# EAGLE design WD1M_BTLE_JDY-08 (EAGLE 7.5.0)
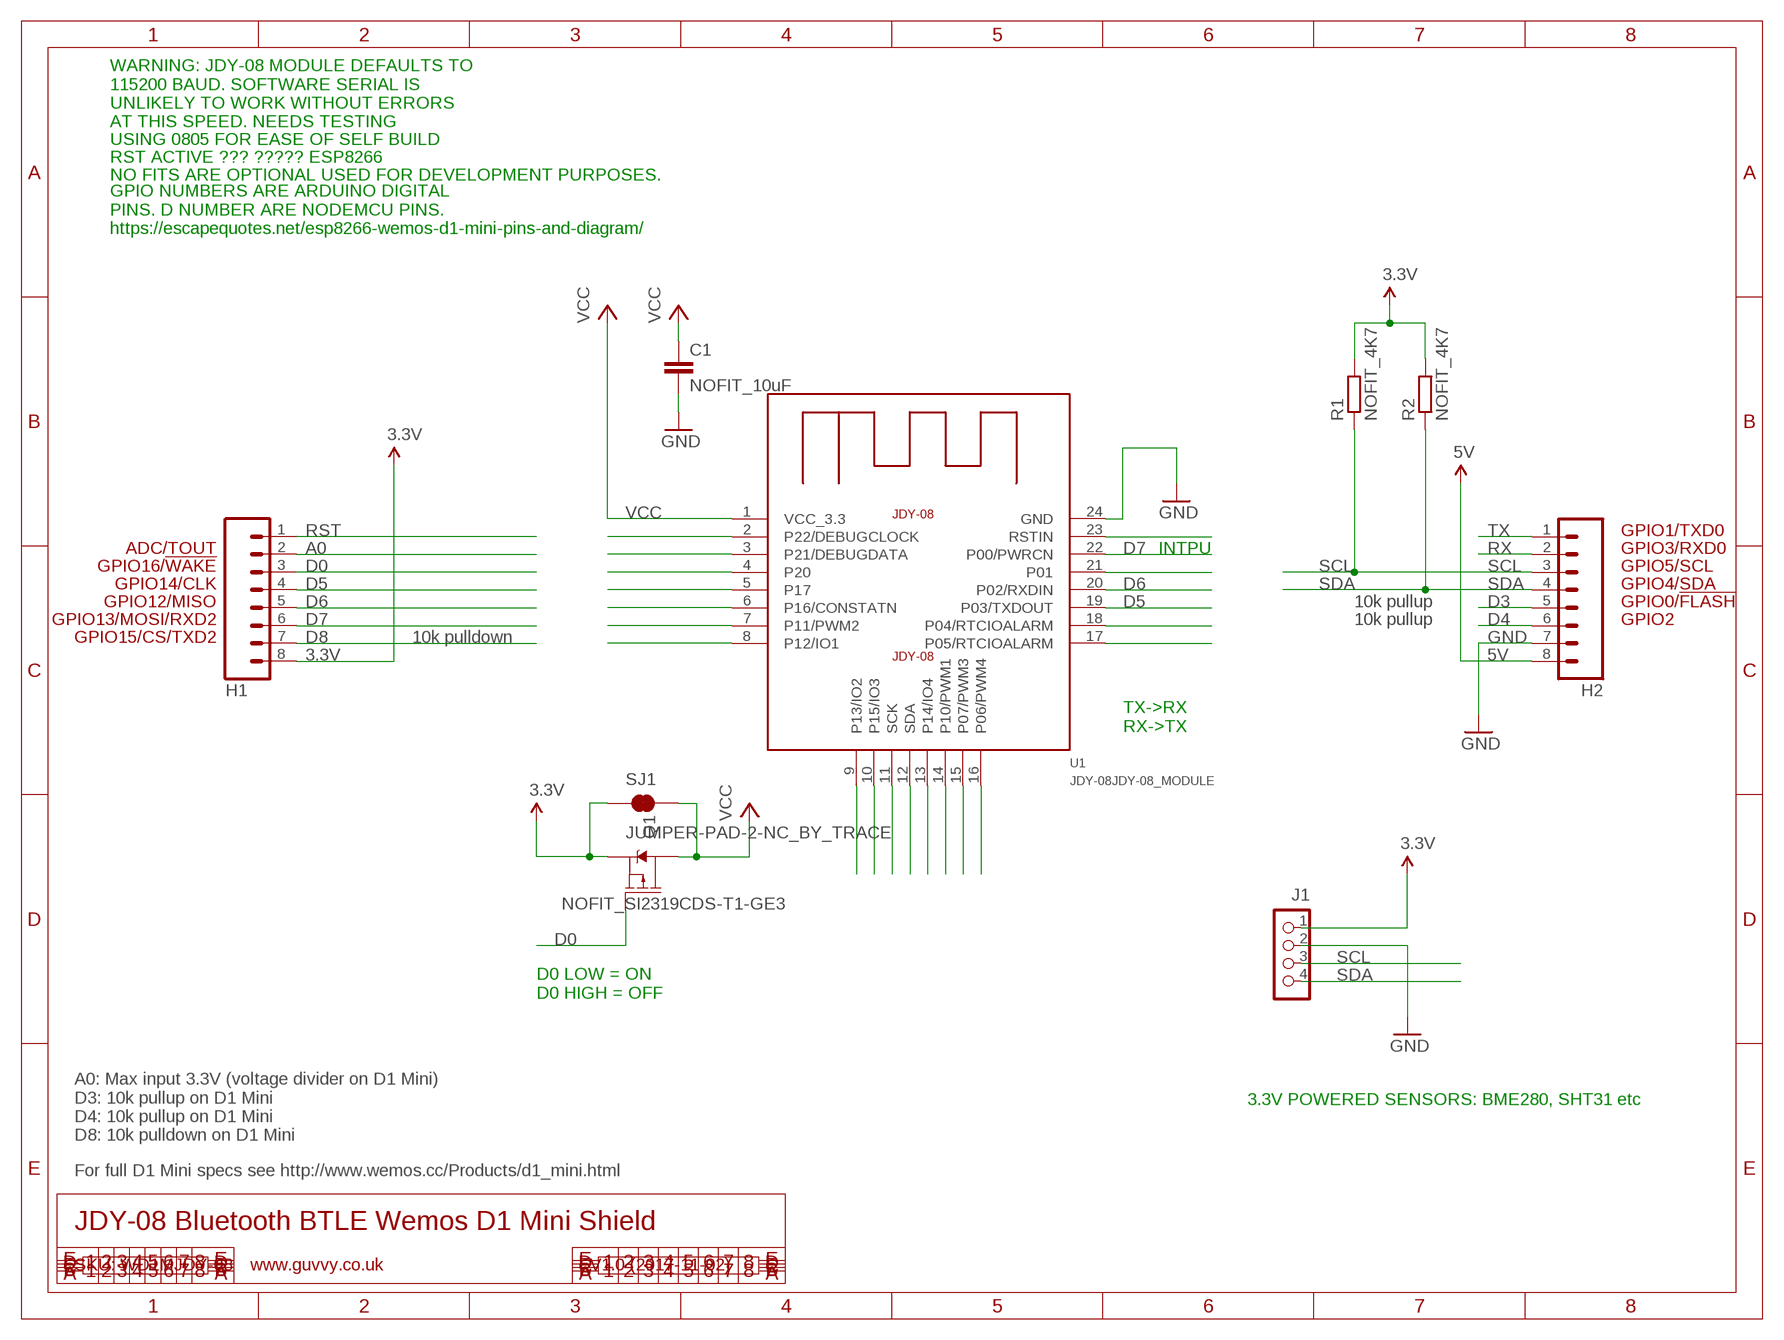
[diagram p0: schematic, sheet 1]

## Parts
C1  NOFIT_10uF  C-EUC0805K  [C0805K]
H1  M08  [1X08]
H2  M08  [1X08]
J1  CON_HEADER_1X04  [M1X4]
Q1  NOFIT_SI2319CDS-T1-GE3  MOSFET_PCH-IRLML2244  [SOT23-3]
R1  NOFIT_4K7  R-EU_R0805  [R0805]
R2  NOFIT_4K7  R-EU_R0805  [R0805]
SJ1  JUMPER-PAD-2-NC_BY_TRACE  [PAD-JUMPER-2-NC_BY_TRACE_YES_SILK]
U1  JDY-08JDY-08_MODULE  [JDY-08]

## Nets
3.3V: H1.8 J1.1 Q1.2(S) R1.2 R2.2 SJ1.1
5V: H2.8
A0: H1.2
D0: H1.3 Q1.1(G)
D3: H2.5
D4: H2.6
D5: H1.4 U1.19(P03/TXDOUT)
D6: H1.5 U1.20(P02/RXDIN)
D7: H1.6 U1.22(P00/PWRCN)
D8: H1.7
GND: C1.2 H2.7 J1.2 U1.24(GND)
N$2: U1.23(RSTIN)
N$3: U1.2(P22/DEBUGCLOCK)
N$4: U1.3(P21/DEBUGDATA)
N$5: U1.4(P20)
N$6: U1.5(P17)
N$7: U1.6(P16/CONSTATN)
N$8: U1.7(P11/PWM2)
N$9: U1.8(P12/IO1)
N$11: U1.21(P01)
N$14: U1.18(P04/RTCIOALARM)
N$15: U1.17(P05/RTCIOALARM)
N$16: U1.9(P13/IO2)
N$17: U1.10(P15/IO3)
N$18: U1.11(SCK)
N$19: U1.12(SDA)
N$20: U1.13(P14/IO4)
N$21: U1.14(P10/PWM1)
N$22: U1.15(P07/PWM3)
N$23: U1.16(P06/PWM4)
RST: H1.1
RX: H2.2
SCL: H2.3 J1.3 R1.1
SDA: H2.4 J1.4 R2.1
TX: H2.1
VCC: C1.1 Q1.3(D) SJ1.2 U1.1(VCC_3.3)

## Notes on the sheet
- WARNING: JDY-08 MODULE DEFAULTS TO
  115200 BAUD. SOFTWARE SERIAL IS 
  UNLIKELY TO WORK WITHOUT ERRORS 
  AT THIS SPEED. NEEDS TESTING
- USING 0805 FOR EASE OF SELF BUILD
- RST ACTIVE ??? ????? ESP8266
- NO FITS ARE OPTIONAL USED FOR DEVELOPMENT PURPOSES.
- GPIO NUMBERS ARE ARDUINO DIGITAL 
  PINS. D NUMBER ARE NODEMCU PINS.
  https://escapequotes.net/esp8266-wemos-d1-mini-pins-and-diagram/
- GPIO1/TXD0
- ADC/TOUT | INTPU | GPIO3/RXD0
- GPIO16/!WAKE | GPIO5/SCL
- GPIO14/CLK | GPIO4/SDA
- GPIO12/MISO | 10k pullup | GPIO0/!FLASH
- GPIO13/MOSI/RXD2 | 10k pullup | GPIO2
- GPIO15/CS/TXD2 | 10k pulldown
- TX->RX
  RX->TX
- D0 LOW = ON
  D0 HIGH = OFF
- 3.3V POWERED SENSORS: BME280, SHT31 etc
- A0: Max input 3.3V (voltage divider on D1 Mini)
  D3: 10k pullup on D1 Mini
  D4: 10k pullup on D1 Mini
  D8: 10k pulldown on D1 Mini
- For full D1 Mini specs see http://www.wemos.cc/Products/d1_mini.html
- JDY-08 Bluetooth BTLE Wemos D1 Mini Shield
- SKU: WD1MJDY-08 | www.guvvy.co.uk | V1.0 (2017-11-02)

## Library data of the parts
C1 = rcl:C-EU: CAPACITOR, European symbol
H1 H2 = freetronics-original:M08: Header 8 Standard 8-pin 0.1" header. Use with straight break away headers (SKU : PRT-00116), right angle break away headers (PRT-00553), swiss pins (PRT-00743), machine pins (PRT-00117), and female headers (PRT-00115).
J1 = dp_devices:CON_HEADER_1X04
Q1 = SparkFun-DiscreteSemi:MOSFET_PCH: P-channel MOSFETs Voltage controlled devices that allow control of high current outputs. SparkFun Products: SparkFun ESP32 Thing <https://www.sparkfun.com/products/13907> SparkFun ESP8266 Thing <https://www.sparkfun.com/products/13231>; PROD_ID: TRANS-11153; VALUE: 4.3A/20V/54mΩ
R1 R2 = rcl:R-EU_: RESISTOR, European symbol
SJ1 = SparkFun-Passives:JUMPER-PAD-2-NC_BY_TRACE
U1 = JDY-08:JDY-08: JDY-08 Bluetooth 4.0 Transceiver based on TI CC2540/CC2541

## Net classes
0 default: width 0.203 mm, drill 0.356 mm, clearance 0.152 mm
1 power: width 0.203 mm, clearance 0.152 mm

## Board
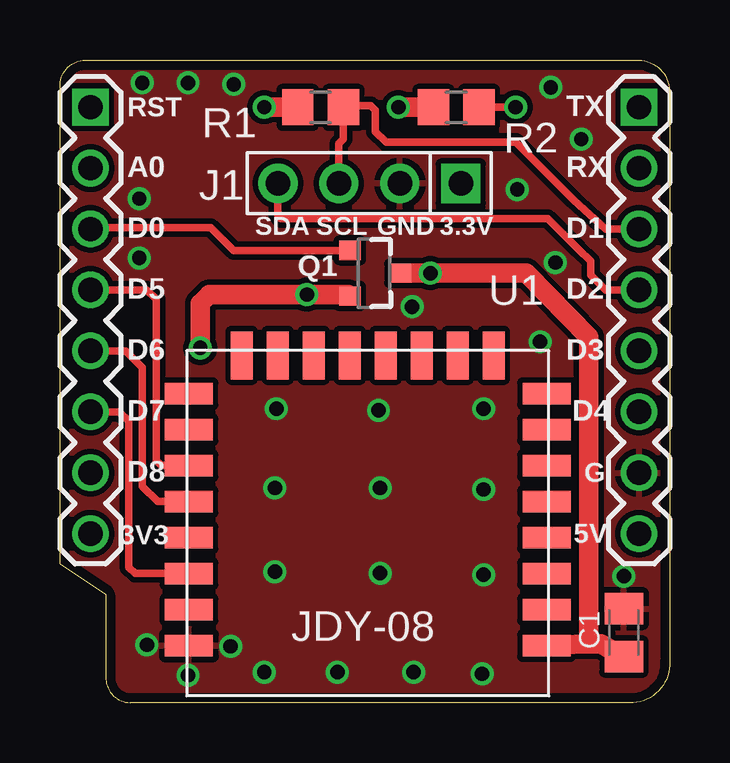
[diagram p1: board, top side]
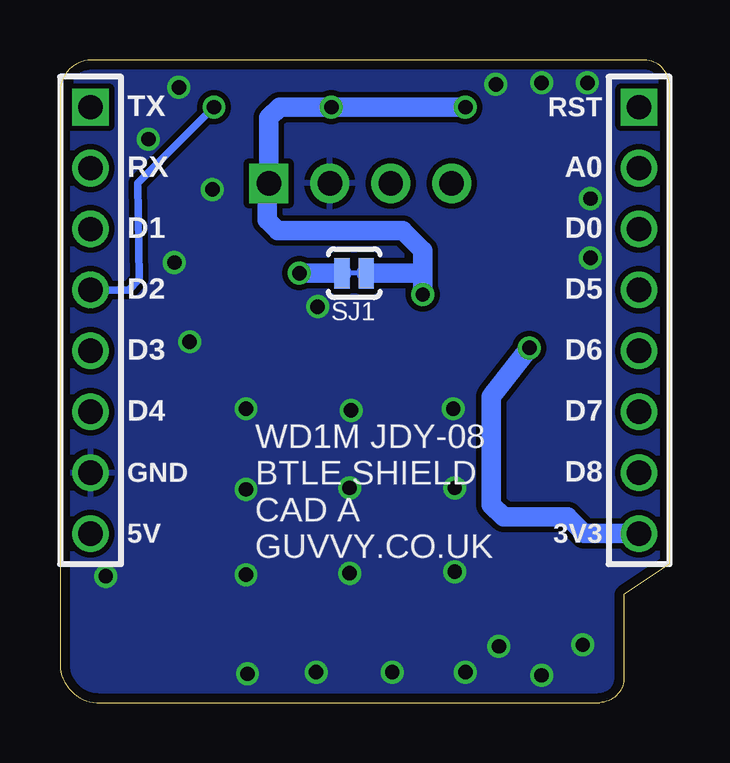
[diagram p2: board, bottom side, seen from below]

Size 25.4 x 26.8 mm. Coordinates in mm from the lower left corner, seen from the top.
Outline: 25.4,25.53 25.4,1.71 arc-90 23.88,0 2.92,0 arc-90 1.9,1.08 1.9,4.51 0,5.78 0,25.78 arc-90 1.14,26.8 24,26.8 arc-90 25.4,25.53
Copper layers (1*16): Top 0.0356mm / dielectric 1.5011mm / Bottom 0.0356mm
Design rules "oshpark-2layer *": minimum track width 6mil, minimum drill 13mil, track to track 6mil, track to pad 6mil, pad to pad 6mil, via to via 6mil, smd to smd 6mil, copper to edge 15mil, drill to drill 6mil, minimum pad ring 7mil, minimum via ring 7mil, stop-mask expansion 2.5mil, vias tented up to drill 25mil, thermal gap 10mil

### Footprints (pad centres in the part's own frame; a part is rotated, then mirrored left to right if it is on the bottom)
C0805K = smd 1.3 x 1.6: 1 -1,0; 2 1,0
1X08 = drill 1.016 square: 1 0,0 | drill 1.016: 2 2.54,0; 3 5.08,0; 4 7.62,0; 5 10.16,0; 6 12.7,0; 7 15.24,0; 8 17.78,0
M1X4 = drill 1.02 pad 1.632 square: 1 0,0 | drill 1.02 pad 1.632: 2 2.54,0; 3 5.08,0; 4 7.62,0
SOT23-3 = smd 0.8 x 0.9: 1 -0.95,-1; 2 0.95,-1; 3 0,1.1
R0805 = smd 1.3 x 1.5: 1 -0.95,0; 2 0.95,0
PAD-JUMPER-2-NC_BY_TRACE_YES_SILK = smd 0.635 x 1.27: 1 -0.508,0; 2 0.508,0
JDY-08 = smd 2 x 0.9: 1 -7.7,6; 2 -7.7,4.5; 3 -7.7,3; 4 -7.7,1.5; 5 -7.7,0; 6 -7.7,-1.5; 7 -7.7,-3; 8 -7.7,-4.5; 17 7.2,-4.5; 18 7.2,-3; 19 7.2,-1.5; 20 7.2,0; 21 7.2,1.5; 22 7.2,3; 23 7.2,4.5; 24 7.2,6 | smd 0.9 x 2: 9 -5.5,-6.1; 10 -4,-6.1; 11 -2.5,-6.1; 12 -1,-6.1; 13 0.5,-6.1; 14 2,-6.1; 15 3.5,-6.1; 16 5,-6.1

### Placement (x,y rotation side)
C1  23.5,2.92 90 top
H1  1.27,24.83 270 top
H2  24.13,24.83 270 top
J1  16.7,21.65 180 top
Q1  13.08,17.91 270 top
R1  10.86,24.83 180 top
R2  16.51,24.83 180 top
SJ1  13.14,17.91 180 bottom
U1  12.57,8.38 180 top

### Tracks (layer width: path | path; a pad name or v marks a point on that pad's centre or on a via)
3.3V  (via drill 0.6)
  Top 0.813: v5.84,14.8 5.84,16.64 6.22,17.02 v10.29,17.02 12.02,17.02 Q1.2 | R1.2 v8.51,24.83 | v14.1,24.83 R2.2
  Bottom 0.813: v5.84,14.8 7.43,12.76 7.43,8.25 6.92,7.75 4.25,7.75 3.56,7.05 H1.8 | 10.29,17.91 10.29,18.86 11.11,19.69 16.32,19.69 16.76,20.13 16.76,21.59 J1.1 16.7,24.38 16.26,24.83 v14.1,24.83 v8.51,24.83 | 10.29,17.91 v10.29,17.02 | SJ1.1 10.29,17.91
D0
  Top 0.305: Q1.1 7.24,18.86 6.29,19.81 1.33,19.81 H1.3
D5
  Top 0.305: U1.19 4.21,9.88 4,10.1 4,16.83 3.62,17.21 H1.4
D6
  Top 0.305: U1.20 4.06,8.38 3.43,9.02 3.43,13.97 2.73,14.67 H1.5
D7
  Top 0.305: U1.22 3.13,5.38 2.86,5.65 2.86,11.75 2.48,12.13 H1.6
GND  (via drill 0.6)
  other vias: 23.5,5.27 3.62,2.41 7.11,2.35 5.33,1.14 3.43,25.84 3.3,21.02 3.3,18.54 14.67,16.51 9.02,12.26 17.65,12.26 17.59,1.21 14.73,1.27 8.51,1.27 11.56,1.27 8.95,8.95 8.95,5.46 17.65,8.89 17.65,5.33 5.33,25.84 20.45,25.65 21.72,23.49 20.64,18.35 13.33,8.95 13.27,12.19 13.33,5.4 20,15.05 19.05,21.4 7.24,25.78
  pour Top (isolate 0.229): 25.4,25.15 arc90 24.26,26.8 0.95,26.8 arc90 0.06,25.78 0,5.78 1.9,4.51 1.9,1.02 arc90 2.86,0 24,0 arc90 25.4,1.91
  pour Bottom (isolate 0.229): 25.4,1.91 25.4,25.08 arc90 24.32,26.8 0.95,26.8 arc90 0,25.27 0,5.78 1.9,4.51 1.9,0.95 arc90 2.73,0 23.94,0 arc90
SCL
  Top 0.305: R1.1 11.81,24.77 | H2.3 22.73,19.75 21.4,20.96 18.99,23.37 13.59,23.37 13.14,23.81 13.14,24.7 12.95,24.89 11.87,24.89 R1.1 | J1.3 11.62,23.3 11.81,23.49 R1.1
SDA  (via drill 0.6)
  Top 0.305: R2.1 v18.99,24.83 | J1.4 9.08,20.32 9.21,20.19 20.32,20.19 21.59,18.92 21.6,18.92 22.11,18.42 22.11,17.83 22.73,17.21 H2.4 24.1,17.24
  Bottom 0.305: H2.4 22.54,17.21 22.1,17.65 22.16,21.65 v18.99,24.83
VCC  (via drill 0.6)
  Top 0.813: U1.1 22.03,2.45 | 22.03,2.45 22.53,2.45 C1.1 | 22.03,2.45 22.03,15.24 19.43,17.91 v15.43,17.91 Q1.3
  Bottom 0.813: SJ1.2 v15.43,17.91

### Text on the board
tPlace: RST | TX | A0 | RX | D0 | SDA | SCL | GND | 3.3V | D1 | D5 | D2 | D6 | D3 | D7 | D4 | D8 | G | 3V3 | 5V
bPlace: RST | TX | A0 | RX | D0 | D1 | D5 | D2 | D6 | D3 | D7 | D4 | D8 | GND | 3V3 | 5V
bNames: WD1M JDY-08 / BTLE SHIELD / CAD A / GUVVY.CO.UK